# EAGLE schematic untitled (EAGLE 9.1.3)

## Sheet 1 of 2
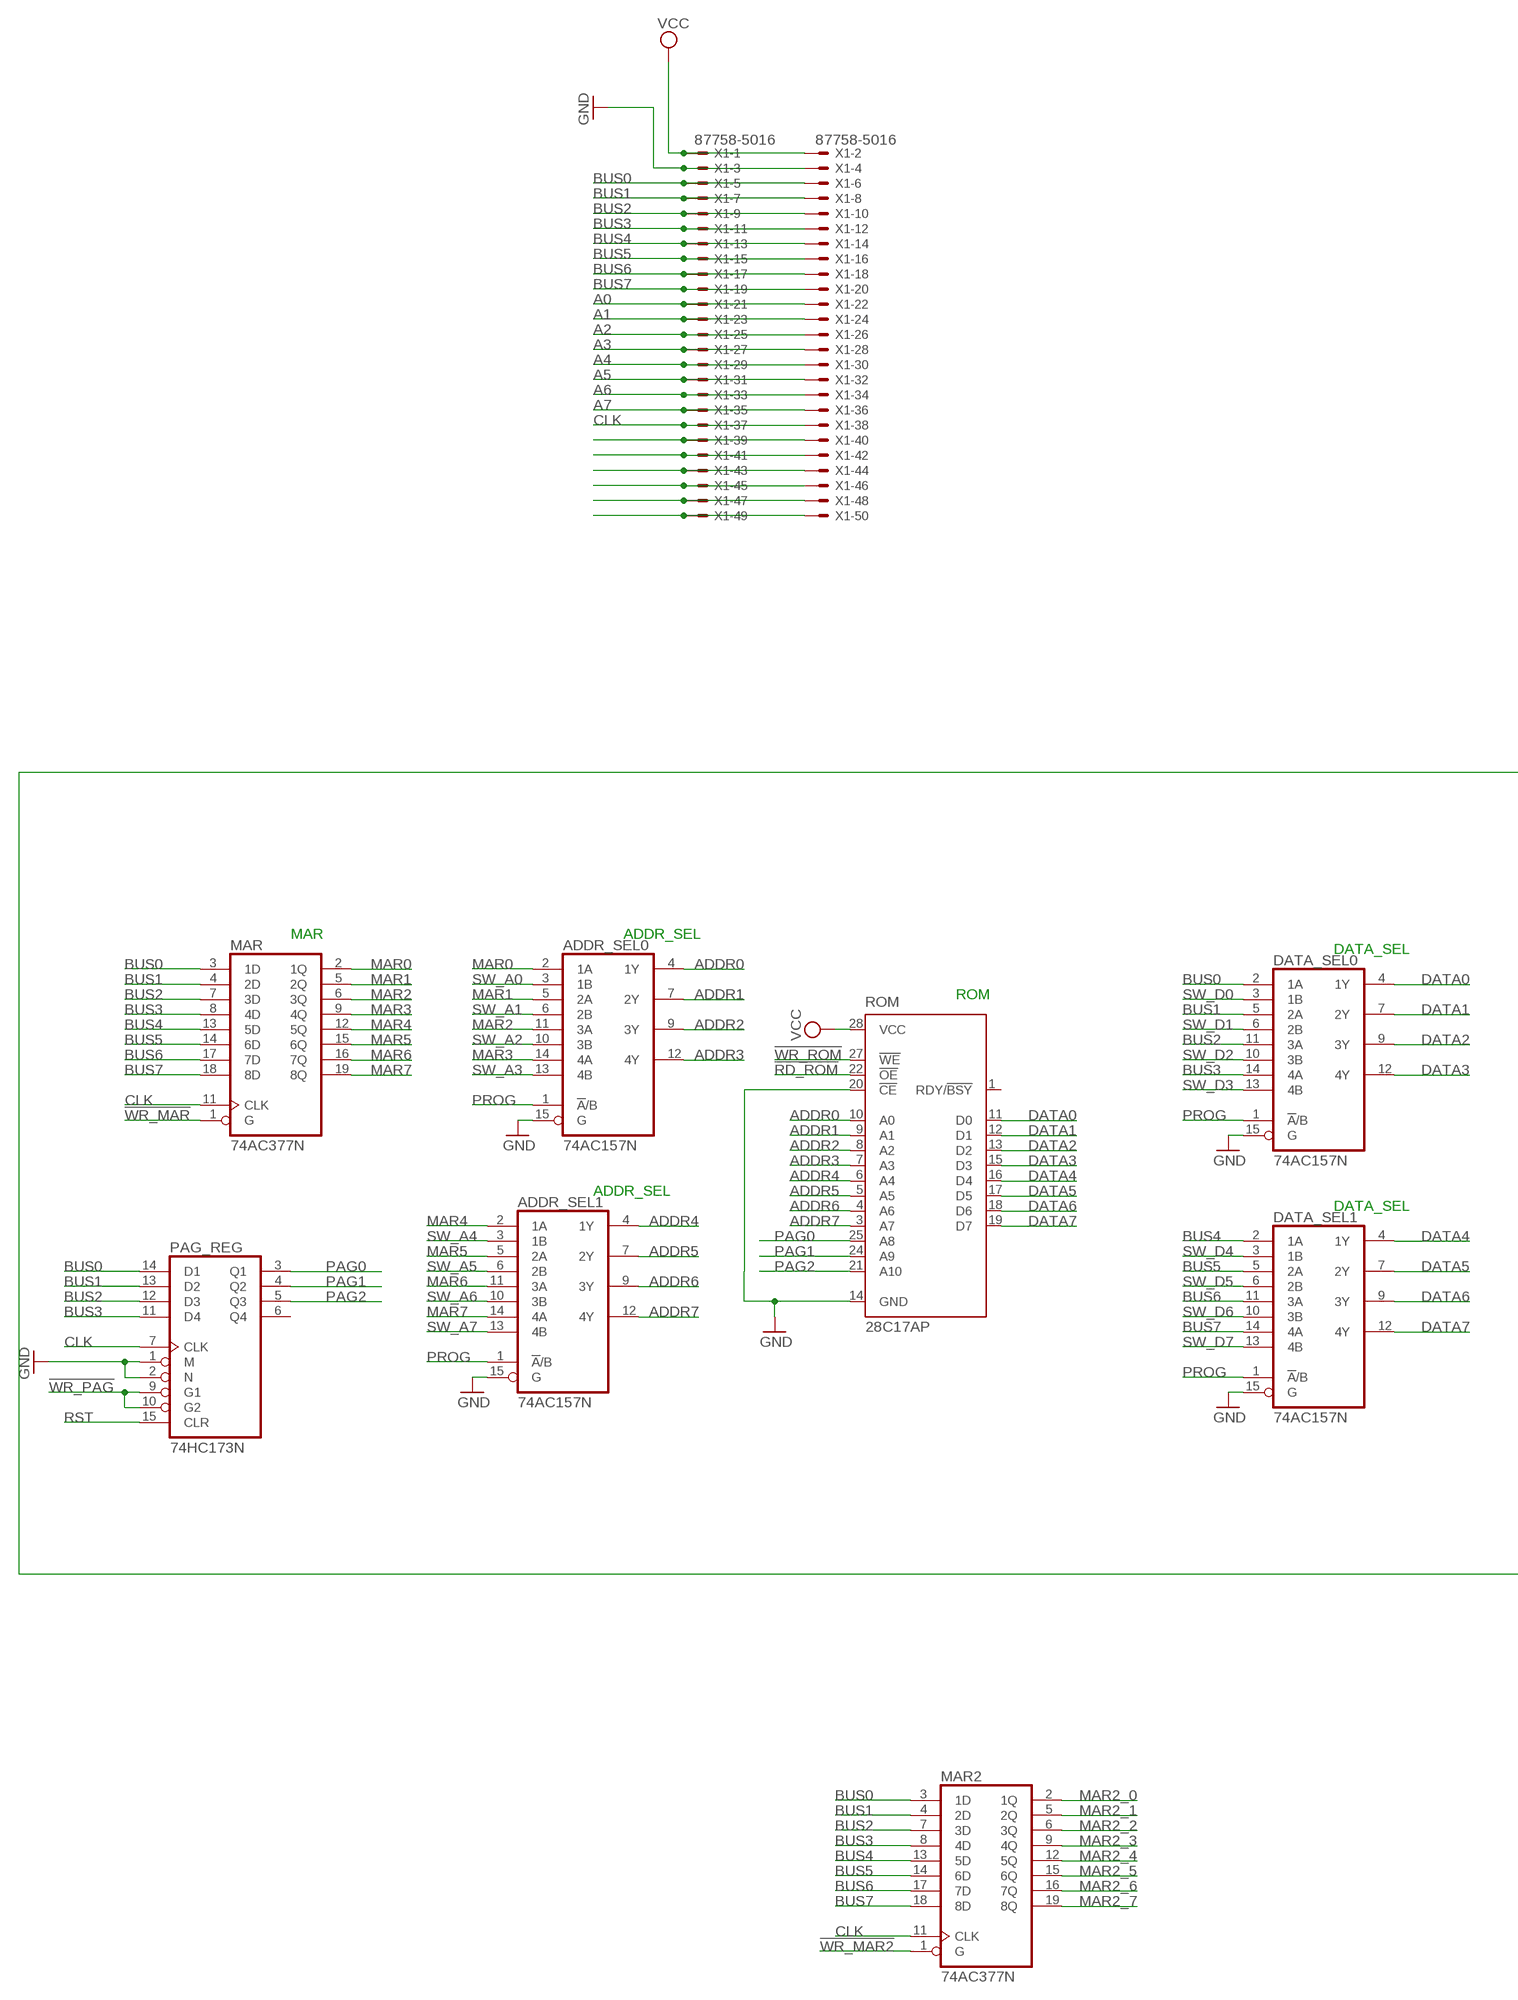
[diagram p0: schematic, sheet 1, part 1 of 2]
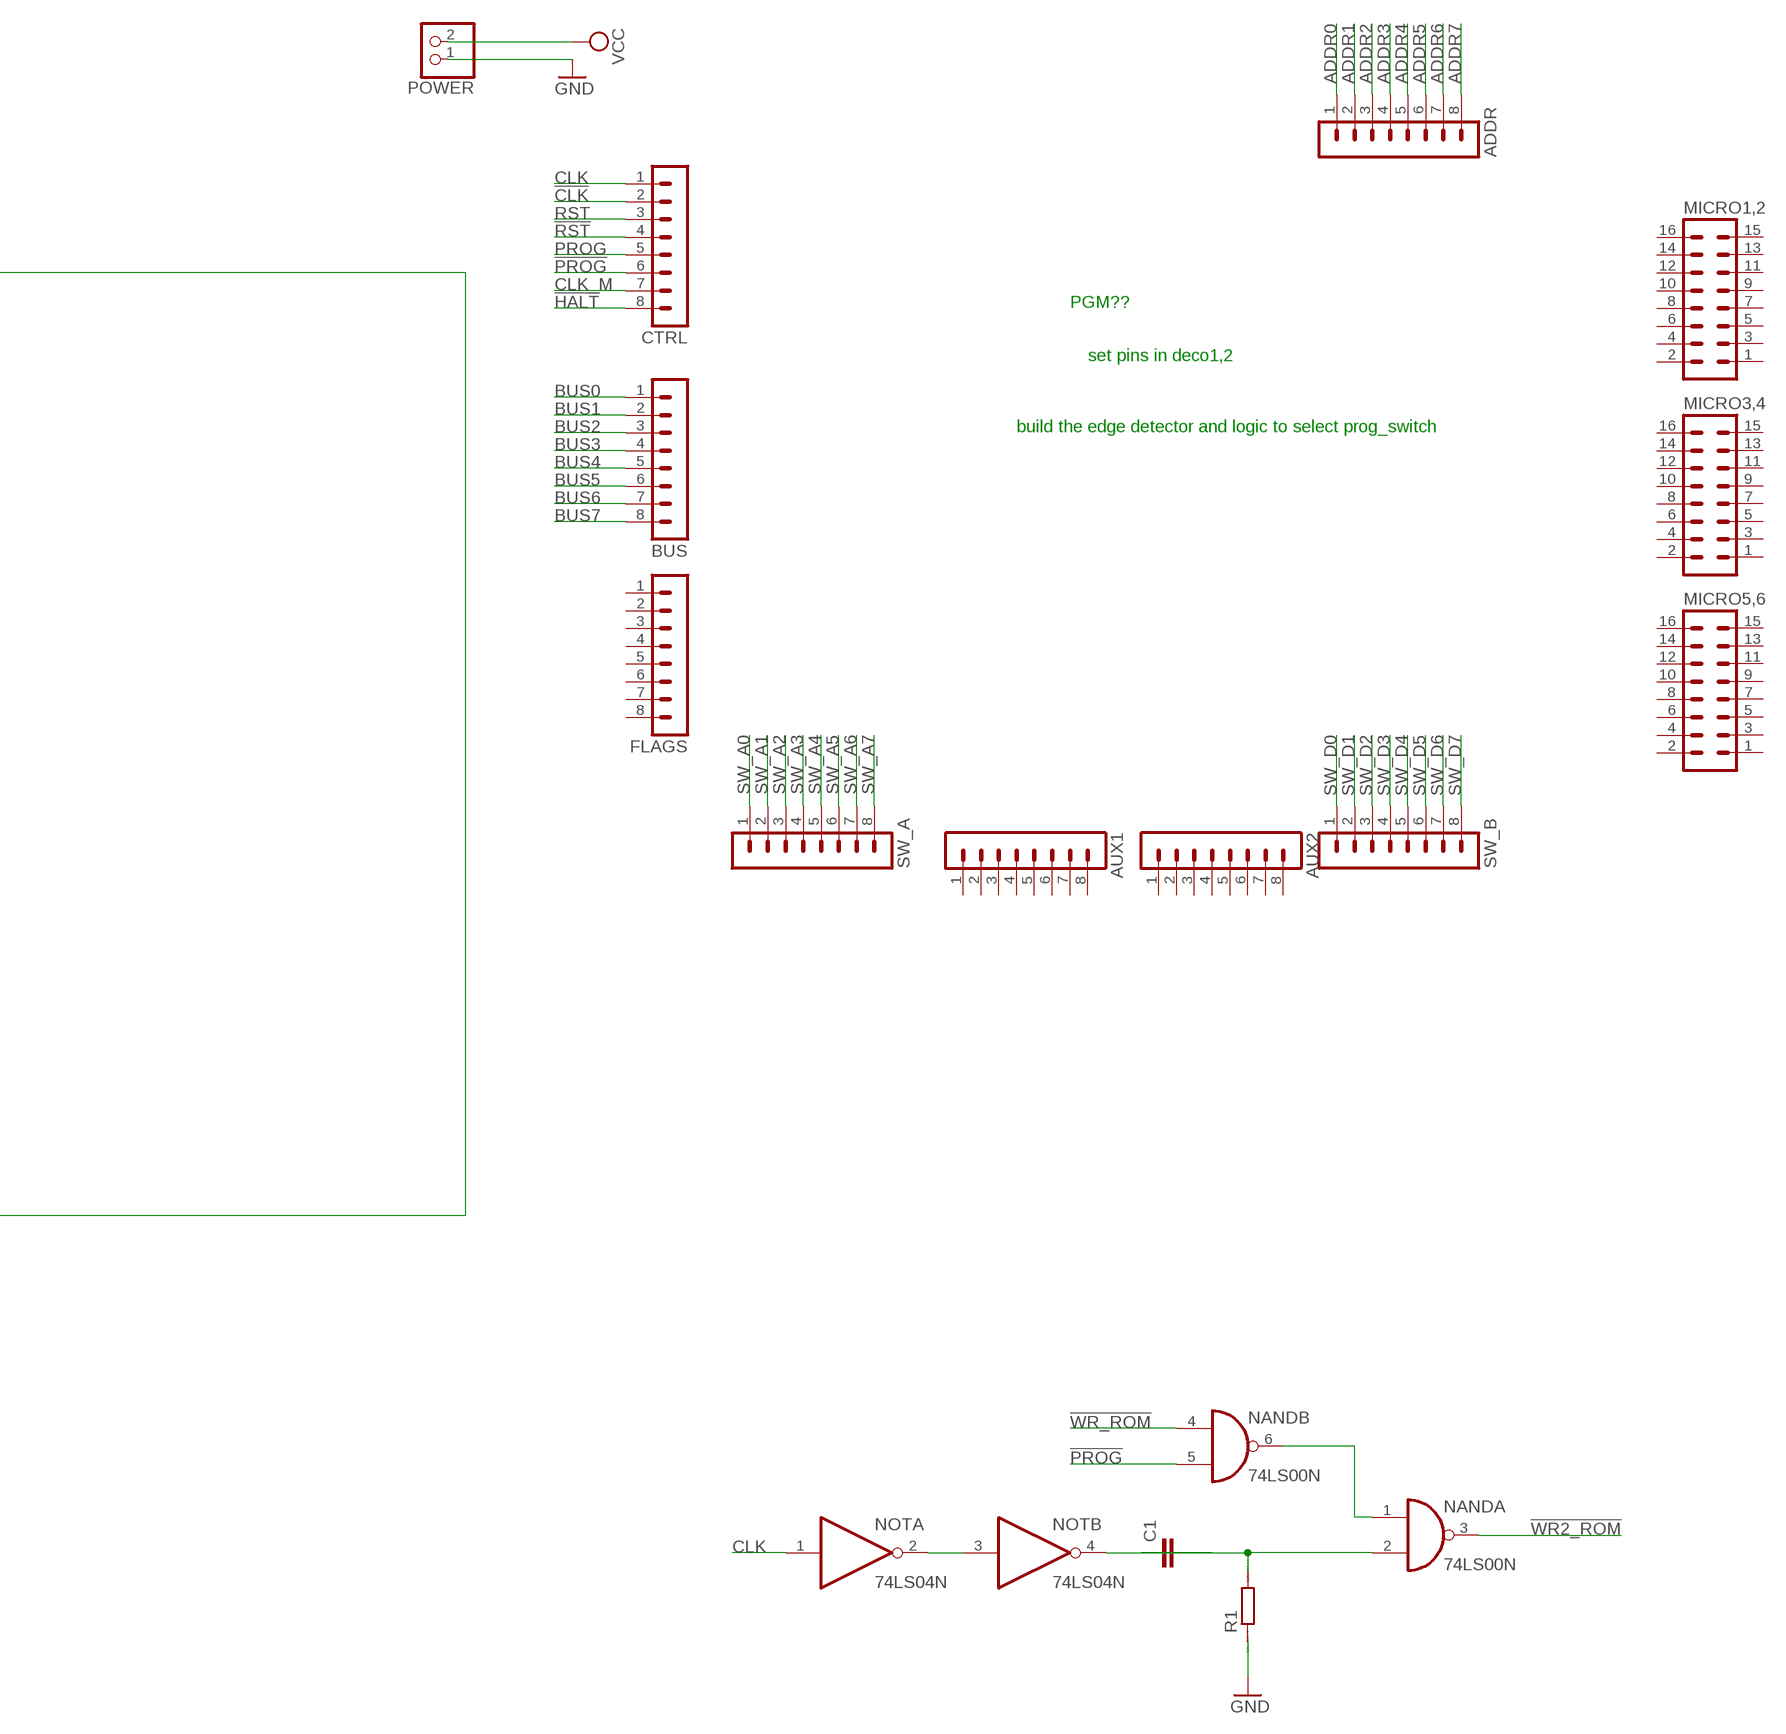
[diagram p1: schematic, sheet 1, part 2 of 2]

### Parts
ADDR  MA08-1  [MA08-1]
ADDR_SEL0  74AC157N  [DIL16]
ADDR_SEL1  74AC157N  [DIL16]
AUX1  MA08-1  [MA08-1]
AUX2  MA08-1  [MA08-1]
BUS  MA08-1  [MA08-1]
C1  C2.5/4  [C2.5-4]
CTRL  MA08-1  [MA08-1]
DATA_SEL0  74AC157N  [DIL16]
DATA_SEL1  74AC157N  [DIL16]
FLAGS  MA08-1  [MA08-1]
MAR  74AC377N  [DIL20]
MAR2  74AC377N  [DIL20]
MICRO1,2  MA08-2  [MA08-2]
MICRO3,4  MA08-2  [MA08-2]
MICRO5,6  MA08-2  [MA08-2]
NAND  74LS00N  [DIL14]
NOT  74LS04N  [DIL14]
PAG_REG  74HC173N  [DIL16]
POWER  PINHD-1X2  [1X02]
R1  R0207/10  [0207/10]
ROM  28C17AP  [DIL28-6]
SW_A  MA08-1  [MA08-1]
SW_B  MA08-1  [MA08-1]
X1  87758-5016  [87758-5016]

### Nets
!CLK: CTRL.2
!HALT: CTRL.8
!PROG: CTRL.6 NAND.5(B:I1)
!RD_ROM: ROM.22(!OE)
!RST: CTRL.4
!WR2_ROM: NAND.3(A:O)
!WR_MAR: MAR.1(G)
!WR_MAR2: MAR2.1(G)
!WR_PAG: PAG_REG.9(G1) PAG_REG.10(G2)
!WR_ROM: NAND.4(B:I0) ROM.27(!WE)
A0: X1.21 X1.22
A1: X1.23 X1.24
A2: X1.25 X1.26
A3: X1.27 X1.28
A4: X1.29 X1.30
A5: X1.31 X1.32
A6: X1.33 X1.34
A7: X1.35 X1.36
ADDR0: ADDR.1 ADDR_SEL0.4(1Y) ROM.10(A0)
ADDR1: ADDR.2 ADDR_SEL0.7(2Y) ROM.9(A1)
ADDR2: ADDR.3 ADDR_SEL0.9(3Y) ROM.8(A2)
ADDR3: ADDR.4 ADDR_SEL0.12(4Y) ROM.7(A3)
ADDR4: ADDR.5 ADDR_SEL1.4(1Y) ROM.6(A4)
ADDR5: ADDR.6 ADDR_SEL1.7(2Y) ROM.5(A5)
ADDR6: ADDR.7 ADDR_SEL1.9(3Y) ROM.4(A6)
ADDR7: ADDR.8 ADDR_SEL1.12(4Y) ROM.3(A7)
BUS0: BUS.1 DATA_SEL0.2(1A) MAR2.3(1D) MAR.3(1D) PAG_REG.14(D1) X1.5 X1.6
BUS1: BUS.2 DATA_SEL0.5(2A) MAR2.4(2D) MAR.4(2D) PAG_REG.13(D2) X1.7 X1.8
BUS2: BUS.3 DATA_SEL0.11(3A) MAR2.7(3D) MAR.7(3D) PAG_REG.12(D3) X1.9 X1.10
BUS3: BUS.4 DATA_SEL0.14(4A) MAR2.8(4D) MAR.8(4D) PAG_REG.11(D4) X1.11 X1.12
BUS4: BUS.5 DATA_SEL1.2(1A) MAR2.13(5D) MAR.13(5D) X1.13 X1.14
BUS5: BUS.6 DATA_SEL1.5(2A) MAR2.14(6D) MAR.14(6D) X1.15 X1.16
BUS6: BUS.7 DATA_SEL1.11(3A) MAR2.17(7D) MAR.17(7D) X1.17 X1.18
BUS7: BUS.8 DATA_SEL1.14(4A) MAR2.18(8D) MAR.18(8D) X1.19 X1.20
CLK: CTRL.1 MAR2.11(CLK) MAR.11(CLK) NOT.1(A:I) PAG_REG.7(CLK) X1.37 X1.38
CLK_M: CTRL.7
DATA0: DATA_SEL0.4(1Y) ROM.11(D0)
DATA1: DATA_SEL0.7(2Y) ROM.12(D1)
DATA2: DATA_SEL0.9(3Y) ROM.13(D2)
DATA3: DATA_SEL0.12(4Y) ROM.15(D3)
DATA4: DATA_SEL1.4(1Y) ROM.16(D4)
DATA5: DATA_SEL1.7(2Y) ROM.17(D5)
DATA6: DATA_SEL1.9(3Y) ROM.18(D6)
DATA7: DATA_SEL1.12(4Y) ROM.19(D7)
GND: ADDR_SEL0.15(G) ADDR_SEL1.15(G) DATA_SEL0.15(G) DATA_SEL1.15(G) PAG_REG.1(M) PAG_REG.2(N) POWER.1 R1.1 ROM.14(GND) ROM.20(!CE) X1.3 X1.4
MAR0: ADDR_SEL0.2(1A) MAR.2(1Q)
MAR1: ADDR_SEL0.5(2A) MAR.5(2Q)
MAR2: ADDR_SEL0.11(3A) MAR.6(3Q)
MAR2_0: MAR2.2(1Q)
MAR2_1: MAR2.5(2Q)
MAR2_2: MAR2.6(3Q)
MAR2_3: MAR2.9(4Q)
MAR2_4: MAR2.12(5Q)
MAR2_5: MAR2.15(6Q)
MAR2_6: MAR2.16(7Q)
MAR2_7: MAR2.19(8Q)
MAR3: ADDR_SEL0.14(4A) MAR.9(4Q)
MAR4: ADDR_SEL1.2(1A) MAR.12(5Q)
MAR5: ADDR_SEL1.5(2A) MAR.15(6Q)
MAR6: ADDR_SEL1.11(3A) MAR.16(7Q)
MAR7: ADDR_SEL1.14(4A) MAR.19(8Q)
N$1: X1.49 X1.50
N$2: NOT.2(A:O) NOT.3(B:I)
N$3: C1.2 NAND.2(A:I1) R1.2
N$4: C1.1 NOT.4(B:O)
N$5: NAND.1(A:I0) NAND.6(B:O)
N$10: X1.39 X1.40
N$13: X1.41 X1.42
N$14: X1.43 X1.44
N$15: X1.45 X1.46
N$16: X1.47 X1.48
PAG0: PAG_REG.3(Q1) ROM.25(A8)
PAG1: PAG_REG.4(Q2) ROM.24(A9)
PAG2: PAG_REG.5(Q3) ROM.21(A10)
PROG: ADDR_SEL0.1(!A!/B) ADDR_SEL1.1(!A!/B) CTRL.5 DATA_SEL0.1(!A!/B) DATA_SEL1.1(!A!/B)
RST: CTRL.3 PAG_REG.15(CLR)
SW_A0: ADDR_SEL0.3(1B) SW_A.1
SW_A1: ADDR_SEL0.6(2B) SW_A.2
SW_A2: ADDR_SEL0.10(3B) SW_A.3
SW_A3: ADDR_SEL0.13(4B) SW_A.4
SW_A4: ADDR_SEL1.3(1B) SW_A.5
SW_A5: ADDR_SEL1.6(2B) SW_A.6
SW_A6: ADDR_SEL1.10(3B) SW_A.7
SW_A7: ADDR_SEL1.13(4B) SW_A.8
SW_D0: DATA_SEL0.3(1B) SW_B.1
SW_D1: DATA_SEL0.6(2B) SW_B.2
SW_D2: DATA_SEL0.10(3B) SW_B.3
SW_D3: DATA_SEL0.13(4B) SW_B.4
SW_D4: DATA_SEL1.3(1B) SW_B.5
SW_D5: DATA_SEL1.6(2B) SW_B.6
SW_D6: DATA_SEL1.10(3B) SW_B.7
SW_D7: DATA_SEL1.13(4B) SW_B.8
VCC: POWER.2 ROM.28(VCC) X1.1 X1.2
Unconnected: AUX1.1 AUX1.2 AUX1.3 AUX1.4 AUX1.5 AUX1.6 AUX1.7 AUX1.8 AUX2.1 AUX2.2 AUX2.3 AUX2.4 AUX2.5 AUX2.6 AUX2.7 AUX2.8 FLAGS.1 FLAGS.2 FLAGS.3 FLAGS.4 FLAGS.5 FLAGS.6 FLAGS.7 FLAGS.8 MICRO1,2.1 MICRO1,2.2 MICRO1,2.3 MICRO1,2.4 MICRO1,2.5 MICRO1,2.6 MICRO1,2.7 MICRO1,2.8 MICRO1,2.9 MICRO1,2.10 MICRO1,2.11 MICRO1,2.12 MICRO1,2.13 MICRO1,2.14 MICRO1,2.15 MICRO1,2.16 MICRO3,4.1 MICRO3,4.2 MICRO3,4.3 MICRO3,4.4 MICRO3,4.5 MICRO3,4.6 MICRO3,4.7 MICRO3,4.8 MICRO3,4.9 MICRO3,4.10 MICRO3,4.11 MICRO3,4.12 MICRO3,4.13 MICRO3,4.14 MICRO3,4.15 MICRO3,4.16 MICRO5,6.1 MICRO5,6.2 MICRO5,6.3 MICRO5,6.4 MICRO5,6.5 MICRO5,6.6 MICRO5,6.7 MICRO5,6.8 MICRO5,6.9 MICRO5,6.10 MICRO5,6.11 MICRO5,6.12 MICRO5,6.13 MICRO5,6.14 MICRO5,6.15 MICRO5,6.16 NAND.8(C:O) NAND.9(C:I0) NAND.10(C:I1) NAND.11(D:O) NAND.12(D:I0) NAND.13(D:I1) NOT.5(C:I) NOT.6(C:O) NOT.8(D:O) NOT.9(D:I) NOT.10(E:O) NOT.11(E:I) NOT.12(F:O) NOT.13(F:I) PAG_REG.6(Q4) ROM.1(RDY/!BSY) ROM.2(NC) ROM.23(NC) ROM.26(NC)

### Notes on the sheet
- PGM??
- set pins in deco1,2
- build the edge detector and logic to select prog_switch
- MAR | ADDR_SEL
- DATA_SEL
- ROM
- ADDR_SEL
- DATA_SEL

## Sheet 2 of 2

## Power pins joined to a net without a drawn wire
GND: ADDR_SEL0.8(GND) ADDR_SEL1.8(GND) DATA_SEL0.8(GND) DATA_SEL1.8(GND) MAR2.10(GND) MAR.10(GND) NAND.7(P:GND) NOT.7(P:GND) PAG_REG.8(GND)
VCC: ADDR_SEL0.16(VCC) ADDR_SEL1.16(VCC) DATA_SEL0.16(VCC) DATA_SEL1.16(VCC) MAR2.20(VCC) MAR.20(VCC) NAND.14(P:VCC) NOT.14(P:VCC) PAG_REG.16(VCC)

## Library data of the parts
ADDR AUX1 AUX2 BUS CTRL FLAGS SW_A SW_B = con-lstb:MA08-1: PIN HEADER; OC_FARNELL: unknown; OC_NEWARK: unknown
ADDR_SEL0 ADDR_SEL1 DATA_SEL0 DATA_SEL1 = 74xx-eu:74*157: Quadruple 2-line to 1-line data SELECTOR/MULTIPLEXER
C1 = capacitor-wima:C: CAPACITOR naming: grid - package width
MAR MAR2 = 74xx-eu:74*377: Octal D type FLIP FLOP, enable
MICRO1,2 MICRO3,4 MICRO5,6 = con-lstb:MA08-2: PIN HEADER; OC_FARNELL: unknown; OC_NEWARK: unknown
NAND = 74xx-eu:74*00: Quad 2-input NAND gate
NOT = 74xx-eu:74*04: Hex INVERTER
PAG_REG = 74xx-eu:74*173: 4-bit D type REGISTER, 3-state
POWER = pinhead:PINHD-1X2: PIN HEADER
R1 = eagle-ltspice:R: RESISTOR, European symbol; SPICEMODEL: NONE; SPICEPREFIX: R
ROM = microchip:28*17A: CMOS EEPROM 16 K (2 K x 8); MPN: CAT28C17ALI20; OC_FARNELL: unknown; OC_NEWARK: 71R7405
X1 = con-molex:87758-5016: 50 Pin - 2mm Dual Row Single Wafer, Vertical T/H HDR Source: http://www.molex.com/pdm_docs/sd/877580616_sd.pdf; MF: MOLEX; MPN: 87758-5016; OC_FARNELL: 7472382; OC_NEWARK: 59J1592